# EAGLE design scarlet (EAGLE 7.7.0)
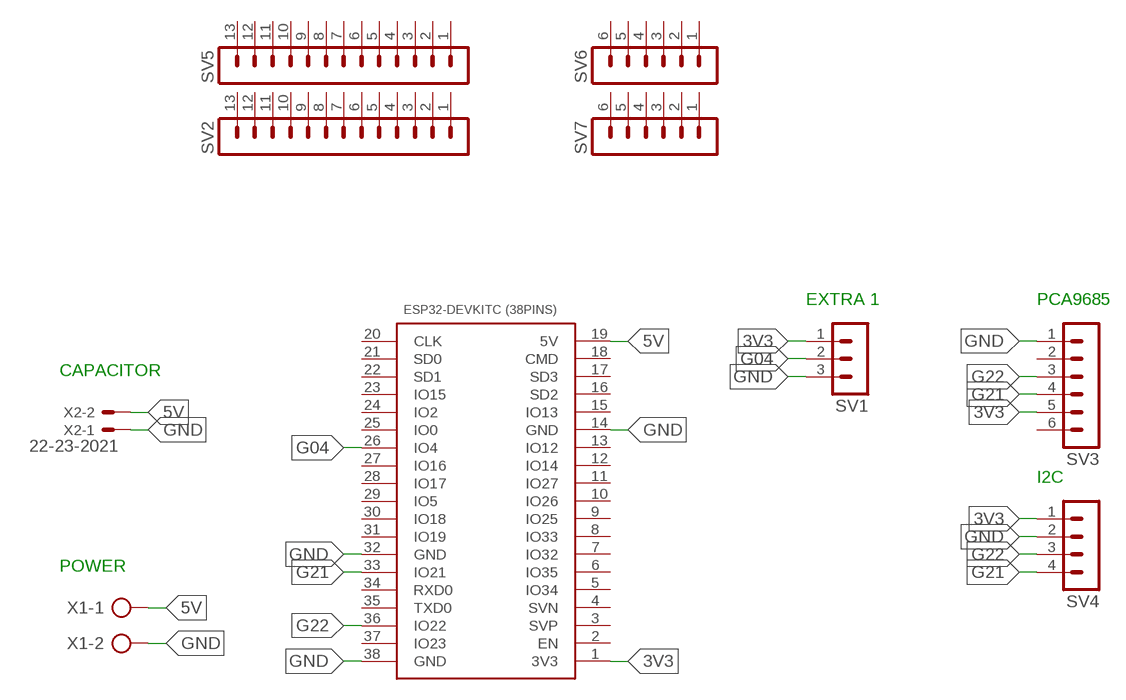
[diagram p0: schematic, sheet 1]

## Parts
ESP32-DEVKITC(38PINS)1  ESP32DEVKITC_38PINS  [ESP32-DEVKITC]
SV1  MA03-1  [MA03-1]
SV2  MA13-1  [MA13-1]
SV3  MA06-1  [MA06-1]
SV4  MA04-1  [MA04-1]
SV5  MA13-1  [MA13-1]
SV6  MA06-1  [MA06-1]
SV7  MA06-1  [MA06-1]
X1  AK300/2  [AK300/2]
X2  22-23-2021  [22-23-2021]

## Nets
3V3: ESP32-DEVKITC(38PINS)1.1(3V3) SV1.1 SV3.5 SV4.1
5V: ESP32-DEVKITC(38PINS)1.19(5V) X1.1 X2.2
G04: ESP32-DEVKITC(38PINS)1.26(IO4) SV1.2
G21: ESP32-DEVKITC(38PINS)1.33(IO21) SV3.4 SV4.4
G22: ESP32-DEVKITC(38PINS)1.36(IO22) SV3.3 SV4.3
GND: ESP32-DEVKITC(38PINS)1.14(GND) ESP32-DEVKITC(38PINS)1.32(GND) ESP32-DEVKITC(38PINS)1.38(GND) SV1.3 SV3.1 SV4.2 X1.2 X2.1
Unconnected: ESP32-DEVKITC(38PINS)1.2(EN) ESP32-DEVKITC(38PINS)1.3(SVP) ESP32-DEVKITC(38PINS)1.4(SVN) ESP32-DEVKITC(38PINS)1.5(IO34) ESP32-DEVKITC(38PINS)1.6(IO35) ESP32-DEVKITC(38PINS)1.7(IO32) ESP32-DEVKITC(38PINS)1.8(IO33) ESP32-DEVKITC(38PINS)1.9(IO25) ESP32-DEVKITC(38PINS)1.10(IO26) ESP32-DEVKITC(38PINS)1.11(IO27) ESP32-DEVKITC(38PINS)1.12(IO14) ESP32-DEVKITC(38PINS)1.13(IO12) ESP32-DEVKITC(38PINS)1.15(IO13) ESP32-DEVKITC(38PINS)1.16(SD2) ESP32-DEVKITC(38PINS)1.17(SD3) ESP32-DEVKITC(38PINS)1.18(CMD) ESP32-DEVKITC(38PINS)1.20(CLK) ESP32-DEVKITC(38PINS)1.21(SD0) ESP32-DEVKITC(38PINS)1.22(SD1) ESP32-DEVKITC(38PINS)1.23(IO15) ESP32-DEVKITC(38PINS)1.24(IO2) ESP32-DEVKITC(38PINS)1.25(IO0) ESP32-DEVKITC(38PINS)1.27(IO16) ESP32-DEVKITC(38PINS)1.28(IO17) ESP32-DEVKITC(38PINS)1.29(IO5) ESP32-DEVKITC(38PINS)1.30(IO18) ESP32-DEVKITC(38PINS)1.31(IO19) ESP32-DEVKITC(38PINS)1.34(RXD0) ESP32-DEVKITC(38PINS)1.35(TXD0) ESP32-DEVKITC(38PINS)1.37(IO23) SV2.1 SV2.2 SV2.3 SV2.4 SV2.5 SV2.6 SV2.7 SV2.8 SV2.9 SV2.10 SV2.11 SV2.12 SV2.13 SV3.2 SV3.6 SV5.1 SV5.2 SV5.3 SV5.4 SV5.5 SV5.6 SV5.7 SV5.8 SV5.9 SV5.10 SV5.11 SV5.12 SV5.13 SV6.1 SV6.2 SV6.3 SV6.4 SV6.5 SV6.6 SV7.1 SV7.2 SV7.3 SV7.4 SV7.5 SV7.6

## Notes on the sheet
- EXTRA 1 | PCA9685
- CAPACITOR
- I2C
- POWER

## Library data of the parts
ESP32-DEVKITC(38PINS)1 = ESP32-DEVKITC(38PINS):ESP32DEVKITC
SV1 = con-lstb:MA03-1: PIN HEADER; OC_FARNELL: unknown; OC_NEWARK: unknown
SV2 SV5 = con-lstb:MA13-1: PIN HEADER; OC_FARNELL: unknown; OC_NEWARK: unknown
SV3 SV6 SV7 = con-lstb:MA06-1: PIN HEADER; OC_FARNELL: unknown; OC_NEWARK: unknown
SV4 = con-lstb:MA04-1: PIN HEADER; OC_FARNELL: unknown; OC_NEWARK: unknown
X1 = con-ptr500:AK300/2: CONNECTOR; OC_FARNELL: unknown; OC_NEWARK: unknown
X2 = con-molex:22-23-2021: .100" (2.54mm) Center Header - 2 Pin; MF: MOLEX; MPN: 22-23-2021; OC_FARNELL: 1462926; OC_NEWARK: 25C3832

## Board
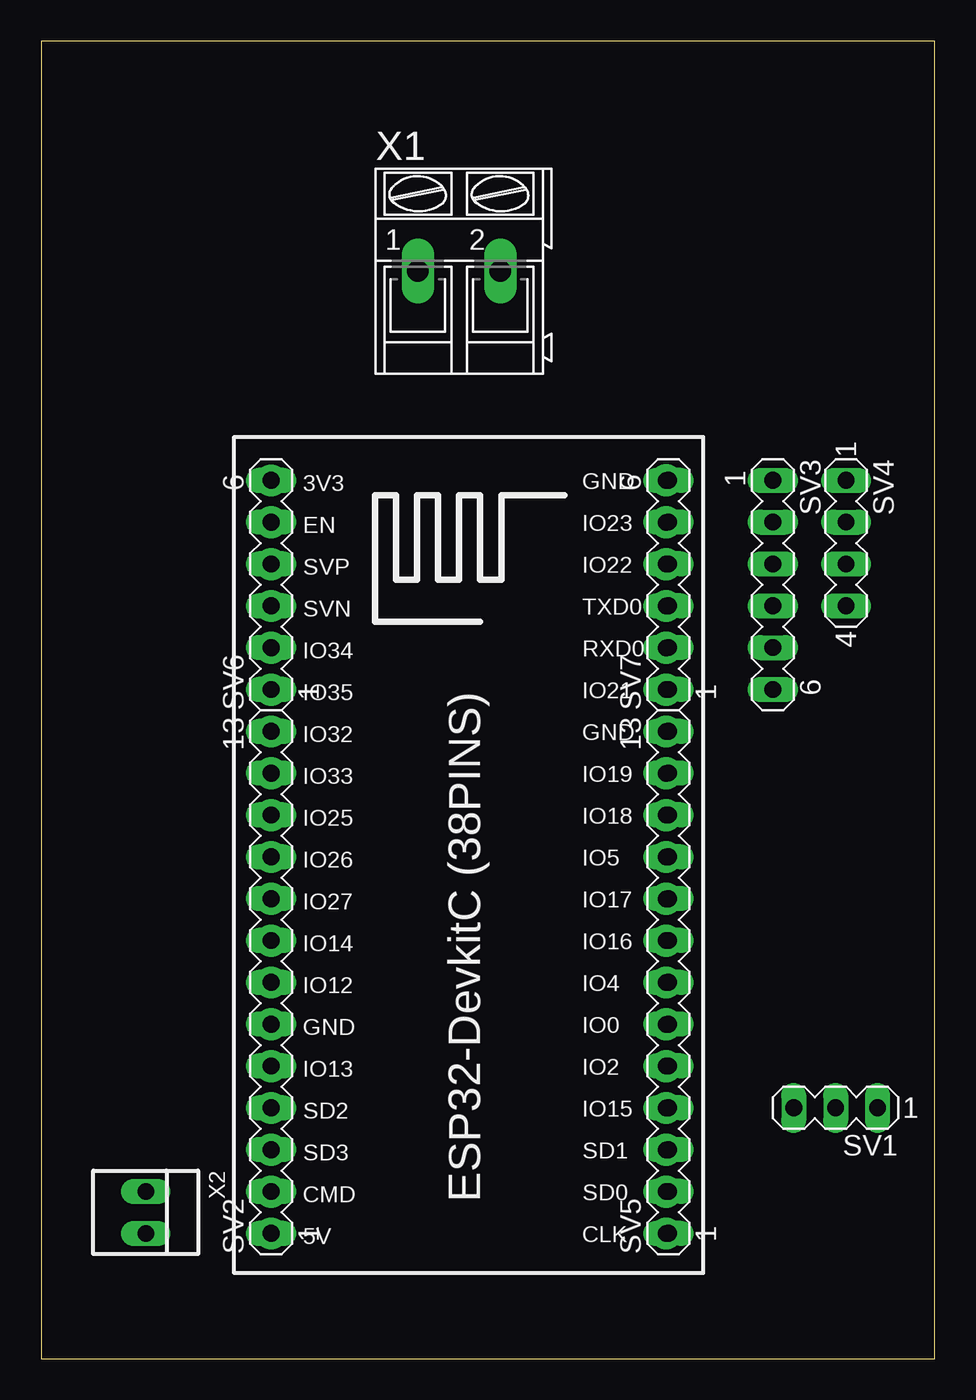
[diagram p1: board, top side]
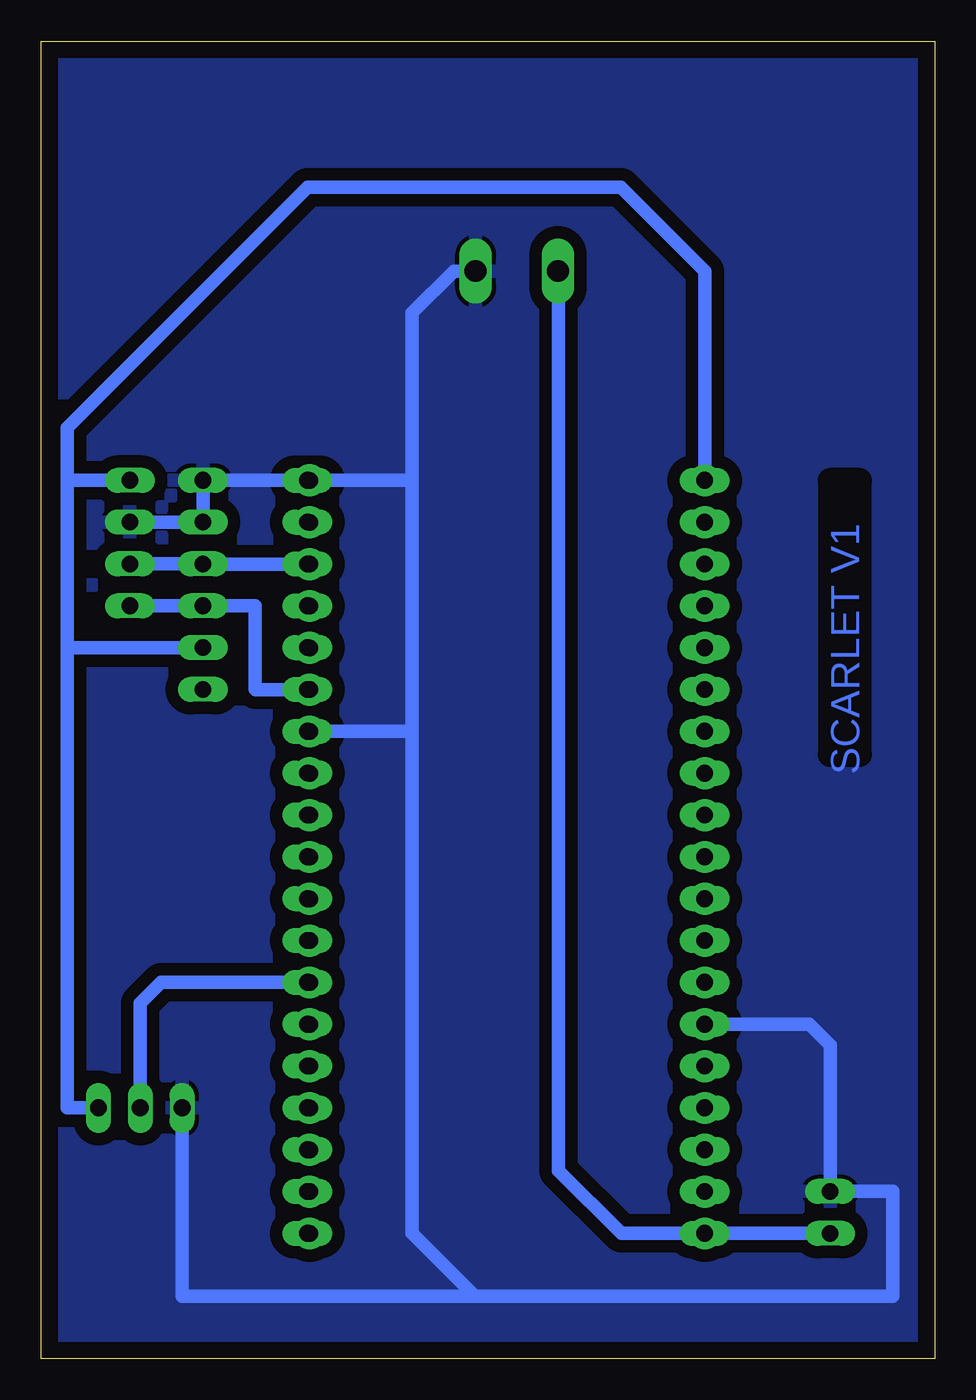
[diagram p2: board, bottom side, seen from below]

Size 54.28 x 80 mm. Coordinates in mm from the lower left corner, seen from the top.
Outline: 0,0 54.28,0 54.28,80 0,80 0,0
Copper layers (1*16): Top 0.035mm / dielectric 1.5mm / Bottom 0.035mm
Design rules "default *": minimum track width 10mil, minimum drill 24mil, track to track 30mil, track to pad 30mil, pad to pad 30mil, via to via 30mil, smd to smd 30mil, copper to edge 40mil, drill to drill 8mil, minimum pad ring 10mil, minimum via ring 8mil, stop-mask expansion 4mil, vias tented up to drill 0mil, thermal gap 10mil

### Footprints (pad centres in the part's own frame; a part is rotated, then mirrored left to right if it is on the bottom)
ESP32-DEVKITC = drill 1 pad 1.93: 1 0.01,0; 2 2.55,0; 3 5.09,0; 4 7.63,0; 5 10.17,0; 6 12.71,0; 7 15.25,0; 8 17.79,0; 9 20.33,0; 10 22.87,0; 11 25.41,0; 12 27.95,0; 13 30.49,0; 14 33.03,0; 15 35.57,0; 16 38.11,0; 17 40.65,0; 18 43.19,0; 19 45.73,0; 20 45.73,24; 21 43.19,24; 22 40.65,24; 23 38.11,24; 24 35.57,24; 25 33.03,24; 26 30.49,24; 27 27.95,24; 28 25.41,24; 29 22.87,24; 30 20.33,24; 31 17.79,24; 32 15.25,24; 33 12.71,24; 34 10.17,24; 35 7.63,24; 36 5.09,24; 37 2.55,24; 38 0,24
MA03-1 = drill 1.016 long: 1 -2.54,0; 2 0,0; 3 2.54,0
MA13-1 = drill 1.016 long: 1 -15.24,0; 2 -12.7,0; 3 -10.16,0; 4 -7.62,0; 5 -5.08,0; 6 -2.54,0; 7 0,0; 8 2.54,0; 9 5.08,0; 10 7.62,0; 11 10.16,0; 12 12.7,0; 13 15.24,0
MA06-1 = drill 1.016 long: 1 -6.35,0; 2 -3.81,0; 3 -1.27,0; 4 1.27,0; 5 3.81,0; 6 6.35,0
MA04-1 = drill 1.016 long: 1 -3.81,0; 2 -1.27,0; 3 1.27,0; 4 3.81,0
AK300/2 = drill 1.321 long: 1 -2.515,0; 2 2.489,0
22-23-2021 = drill 1 long: 1 -1.27,0; 2 1.27,0

### Placement (x,y rotation side)
ESP32-DEVKITC(38PINS)1  13.97,53.34 270 top
SV1  48.26,15.24 180 top
SV2  13.97,22.86 90 top
SV3  44.45,46.99 270 top
SV4  48.9,49.53 270 top
SV5  38.1,22.86 90 top
SV6  13.97,46.99 90 top
SV7  38.1,46.99 90 top
X1  25.4,66.04 0 top
X2  6.35,8.89 270 top

### Tracks (layer width: path | path; a pad name or v marks a point on that pad's centre or on a via)
3V3
  Bottom 0.813: ESP32-DEVKITC(38PINS)1.1 13.97,66.04 19.05,71.12 38.1,71.12 52.7,56.52 52.7,53.34 | SV1.1 52.7,15.24 52.7,43.18 | 52.7,43.18 52.7,53.34 | SV4.1 52.7,53.34 | SV3.5 52.7,43.18
5V
  Bottom 0.813: X2.2 ESP32-DEVKITC(38PINS)1.19 19.04,7.61 22.86,11.43 22.86,66.02 X1.1
G04
  Bottom 0.813: SV1.2 48.26,21.59 46.99,22.86 ESP32-DEVKITC(38PINS)1.26
G21
  Bottom 0.813: ESP32-DEVKITC(38PINS)1.33 41.27,40.63 41.27,40.64 41.27,45.72 SV3.4 SV4.4
G22
  Bottom 0.813: ESP32-DEVKITC(38PINS)1.36 SV3.3 SV4.3
GND
  Bottom 0.813: ESP32-DEVKITC(38PINS)1.14 7.62,20.32 6.35,19.05 X2.1 2.54,10.16 2.54,3.81 27.94,3.81 | ESP32-DEVKITC(38PINS)1.32 31.76,38.09 31.75,38.1 | 31.75,38.1 31.75,7.62 27.94,3.81 | 27.94,3.81 45.72,3.81 SV1.3 | 31.75,53.34 ESP32-DEVKITC(38PINS)1.38 SV3.1 44.45,50.8 SV4.2 | 31.75,53.34 31.75,38.1 | X1.2 29.21,66.04 31.75,63.5 31.75,53.34
  pour Bottom: 0,0 54.61,0 54.61,80.01 0,80.01

### Text on the board
Bottom: SCARLET V1 🐧